# Altium schematic sheet MCU.SchDoc
size A3
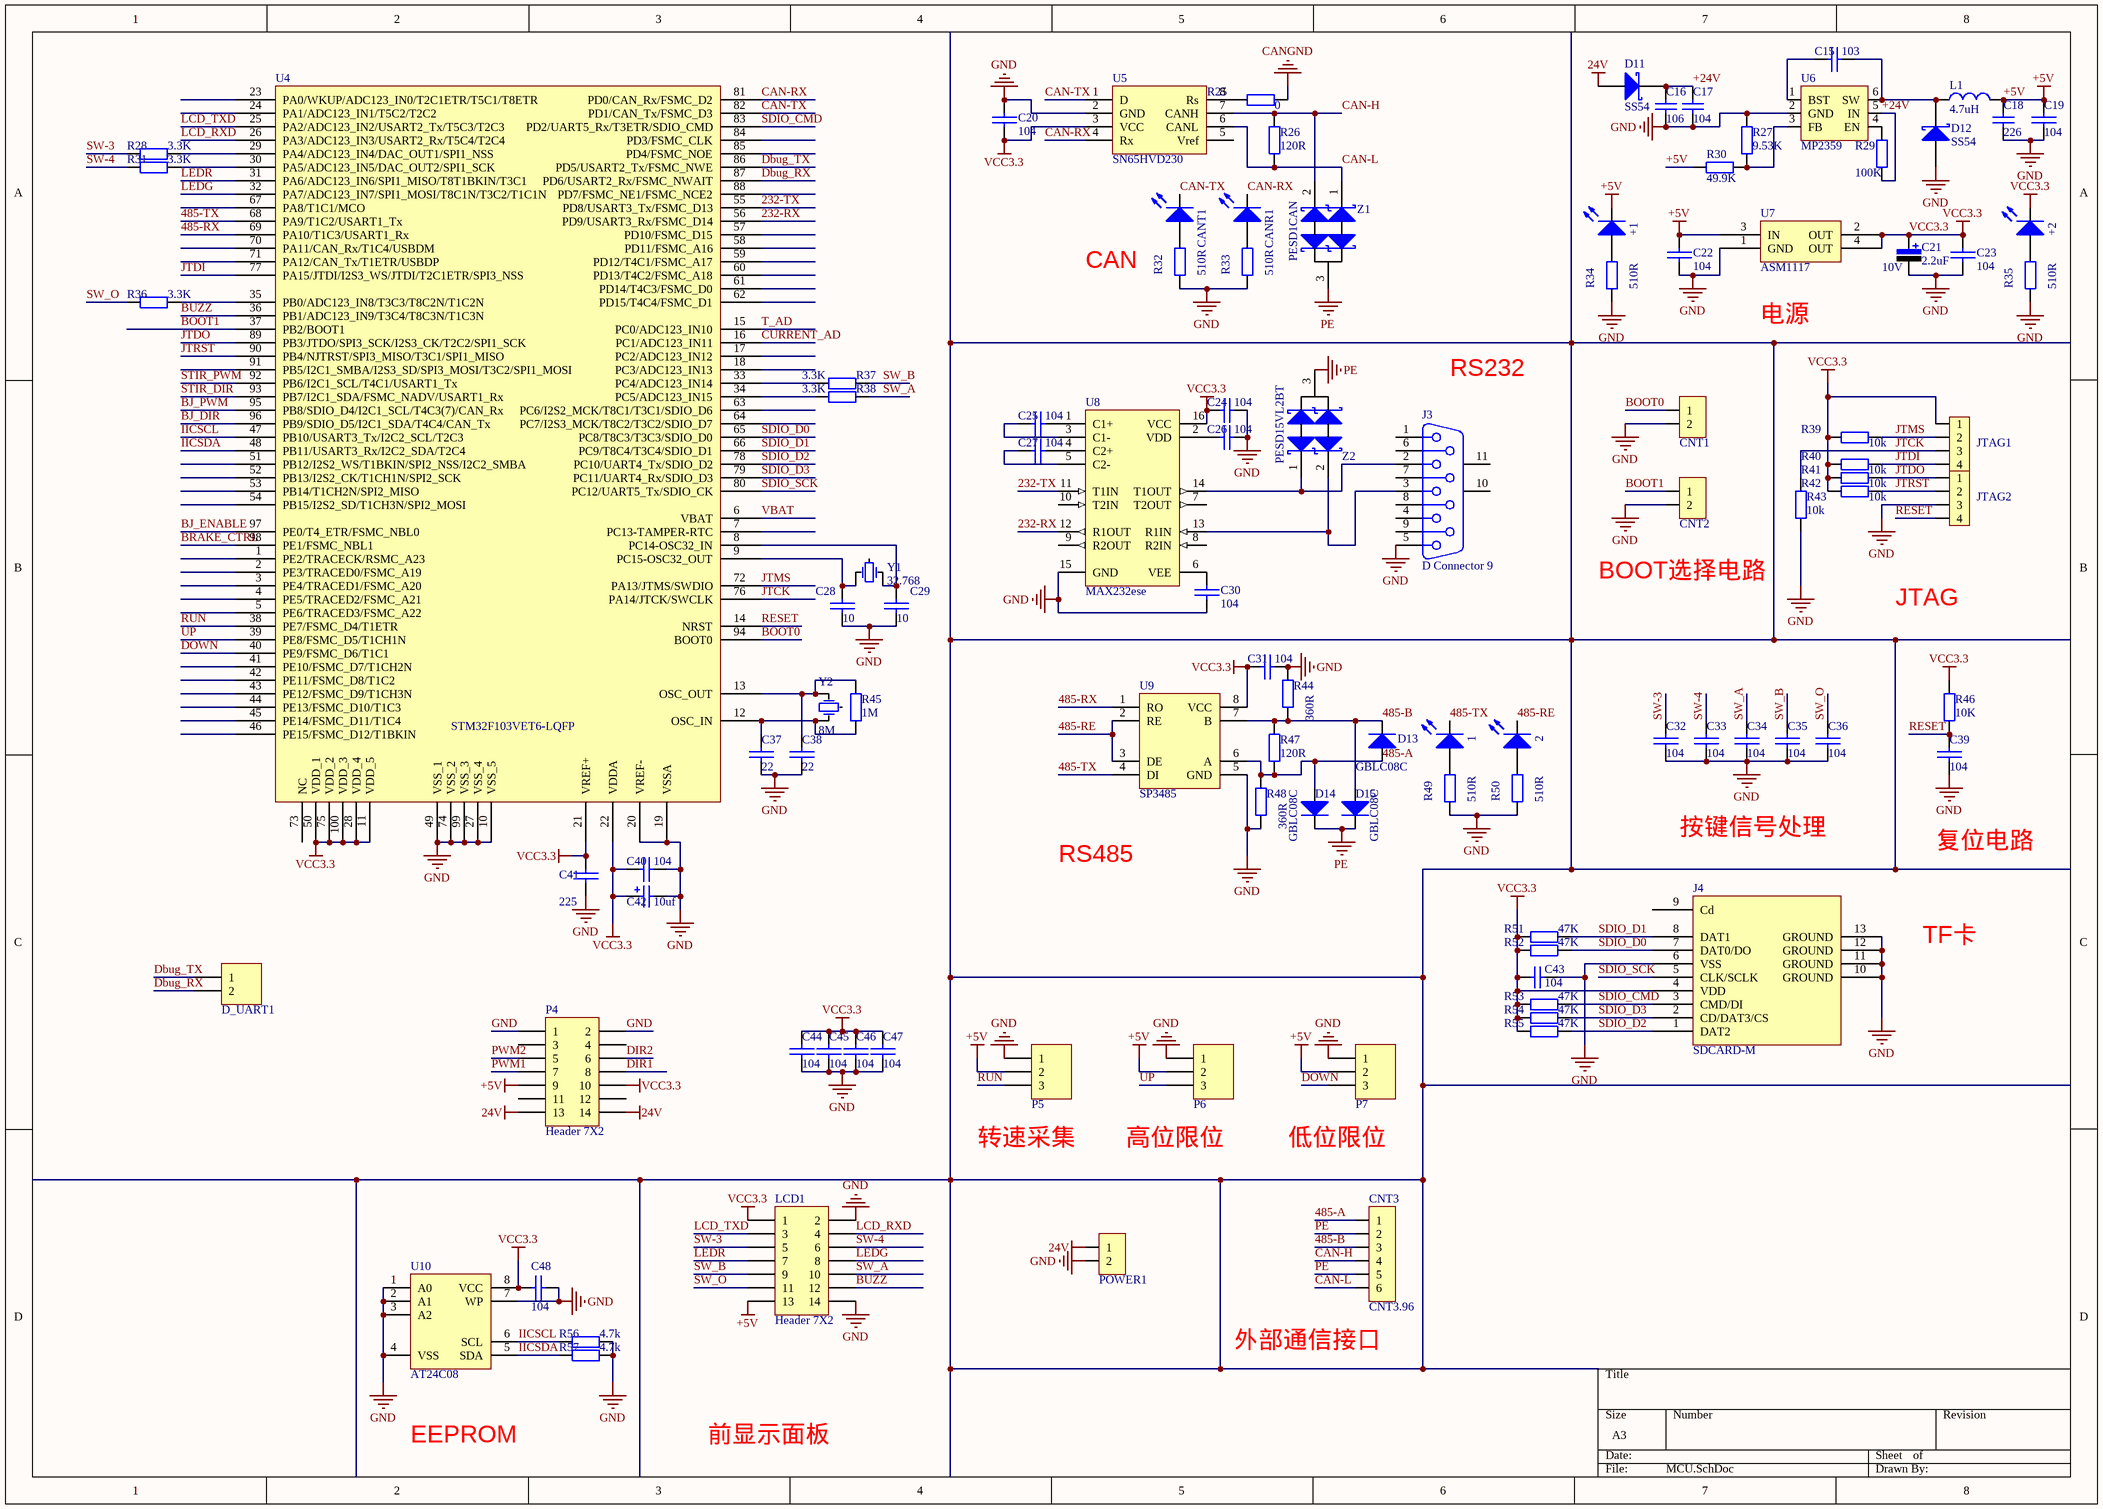
[diagram p0: MCU.SchDoc]

## Parts
1  COLOUR  [0603LED]  (value not drawn)
2  COLOUR  [0603LED]  (value not drawn)
+1  COLOUR  [0603LED]  (value not drawn)
+2  COLOUR  [0603LED]  (value not drawn)
C15  103  [0603C]
C16  容量: 106  [1210]  (hidden comment: 1210)
C17  value 104  [0603-2]  (hidden comment: Cap)
C18  value 226  [1206]  (hidden comment: Cap)
C19  104  [0603C]
C20  104  [0603C]
C21  value 2.2uF  Vol: 10V  [CAP-3216]  (hidden comment: Cap Pol)
C22  104  [0603C]
C23  104  [0603C]
C24  104  [0603C]
C25  104  [0603C]
C26  104  [0603C]
C27  104  [0603C]
C28  10  [0603C]
C29  10  [0603C]
C30  104  [0603C]
C31  104  [0603C]
C32  104  [0603C]
C33  104  [0603C]
C34  104  [0603C]
C35  104  [0603C]
C36  104  [0603C]
C37  22  [0603C]
C38  22  [0603C]
C39  104  [0603C]
C40  104  [0603C]
C41  225  [0603C]
C42  10uf  [ct3216-18]
C43  value 104  [C-RAD-0603]  (hidden comment: Cap)
C44  104  [0603C]
C45  104  [0603C]
C46  104  [0603C]
C47  104  [0603C]
C48  104  [0603C]
CANR1  COLOUR  [0603LED]  (value not drawn)
CANT1  COLOUR  [0603LED]  (value not drawn)
CNT1  cnt2p  [cont-1]  (value not drawn)
CNT2  cnt2p  [cont-1]  (value not drawn)
CNT3  CNT3.96  [CNT3.96]
D11  Type: SS54  [DIODE-SMA]  (hidden comment: D-Schottky)
D12  Type: SS54  [DIODE-SMA]  (hidden comment: D-Schottky)
D13  Type: GBLC08C  [DIODE-1206]  (hidden comment: TVS)
D14  Type: GBLC08C  [DIODE-1206]  (hidden comment: TVS)
D15  Type: GBLC08C  [DIODE-1206]  (hidden comment: TVS)
D_UART1  Header 2  [HDR2X1_A]  (value not drawn)
J3  D Connector 9  [DB9-F]
J4  SDCARD-M  [SDCARD-M]
JTAG1  单排插针11mm4p  [单排插针2.54]  (value not drawn)
JTAG2  单排插针11mm4p  [单排插针2.54]  (value not drawn)
L1  value 4.7uH  [L-SMD-7]  (hidden comment: Inductor)
LCD1  Header 7X2  [HDR7X2_A1]
P4  Header 7X2  [HDR7X2_A1]
P5  Header 3  [XH2.54*3卧贴]  (value not drawn)
P6  Header 3  [XH2.54*3卧贴]  (value not drawn)
P7  Header 3  [XH2.54*3卧贴]  (value not drawn)
POWER1  CNT5.08MM*2 WAN  [CNT5.08*2WAN]  (value not drawn)
R25  value 0  [0603-1]  (hidden comment: Res1)
R26  value 120R  [0603-1]  (hidden comment: Res1)
R27  value 9.53K  [0603-1]  (hidden comment: Res1)
R28  value 3.3K  [0603-1]  (hidden comment: Res1)
R29  value 100K  [0603-1]  (hidden comment: Res1)
R30  value 49.9K  [0603-1]  (hidden comment: Res1)
R31  value 3.3K  [0603-1]  (hidden comment: Res1)
R32  value 510R  [0603-1]  (hidden comment: Res1)
R33  value 510R  [0603-1]  (hidden comment: Res1)
R34  value 510R  [0603-1]  (hidden comment: Res1)
R35  value 510R  [0603-1]  (hidden comment: Res1)
R36  value 3.3K  [0603-1]  (hidden comment: Res1)
R37  value 3.3K  [0603-1]  (hidden comment: Res1)
R38  value 3.3K  [0603-1]  (hidden comment: Res1)
R39  value 10k  [0603-1]  (hidden comment: Res1)
R40  value 10k  [0603-1]  (hidden comment: Res1)
R41  value 10k  [0603-1]  (hidden comment: Res1)
R42  value 10k  [0603-1]  (hidden comment: Res1)
R43  value 10k  [0603-1]  (hidden comment: Res1)
R44  value 360R  [0603-1]  (hidden comment: Res1)
R45  value 1M  [0603-1]  (hidden comment: Res1)
R46  value 10K  [0603-1]  (hidden comment: Res1)
R47  value 120R  [0603-1]  (hidden comment: Res1)
R48  value 360R  [0603-1]  (hidden comment: Res1)
R49  value 510R  [0603-1]  (hidden comment: Res1)
R50  value 510R  [0603-1]  (hidden comment: Res1)
R51  value 47K  [0603-1]  (hidden comment: Res1)
R52  value 47K  [0603-1]  (hidden comment: Res1)
R53  value 47K  [0603-1]  (hidden comment: Res1)
R54  value 47K  [0603-1]  (hidden comment: Res1)
R55  value 47K  [0603-1]  (hidden comment: Res1)
R56  value 4.7k  [0603-1]  (hidden comment: Res1)
R57  value 4.7k  [0603-1]  (hidden comment: Res1)
U4  STM32F103VET6-LQFP  [LQFP-100_M]
U5  SN65HVD230  [NSO8_N]
U6  MP2359  [SOT23-6]
U7  ASM1117  [SOT-223]
U8  MAX232ese  [NSO16_M]
U9  SP3485  [NSO8_N]
U10  AT24C08  [SOIC8_N]
Y1  value 32.768  [MC-146]  (hidden comment: XTAL_SM)
Y2  value 8M  [xtal3225]  (hidden comment: XTAL_SM)
Z1  PESD1CAN  [SOT-23]
Z2  PESD15VL2BT  [SOT-23]

## Nets
24V: D11.1(A) P4.13 P4.14 POWER1.1
+5V: +1.2(-) C18.2 C19.1 C22.1 L1.2 LCD1.13 P4.9 P5.2 P6.2 P7.2 R30.2 U7.3(IN)
CANGND: R25.1
GND: C16.1 C17.1 C18.1 C19.2 C20.1 C21.2 C22.2 C23.2 C24.1 C26.1 C28.2 C29.2 C30.1 C31.1 C32.2 C33.2 C34.2 C35.2 C36.2 C37.2 C38.2 C39.1 C40.1 C41.1 C42.2 C43.2 C44.1 C45.1 C46.1 C47.1 C48.1 CNT1.2 CNT2.2 D12.1(A) J3.5 J4.6(VSS) J4.10(GROUND) J4.11(GROUND) J4.12(GROUND) J4.13(GROUND) JTAG2.3 LCD1.2 LCD1.14 P4.1 P4.2 P5.1 P6.1 P7.1 POWER1.2 R27.2 R32.1 R33.1 R34.1 R35.1 R43.2 R44.2 R48.1 R49.1 R50.1 R56.1 R57.1 U4.10(VSS_5) U4.19(VSSA) U4.20(VREF-) U4.27(VSS_4) U4.49(VSS_1) U4.74(VSS_2) U4.99(VSS_3) U5.2(GND) U6.2(GND) U7.1(GND) U8.15(GND) U9.5(GND) U10.1(A0) U10.2(A1) U10.3(A2) U10.4(VSS) U10.7(WP)
PE: CNT3.2 CNT3.5 D14.2(K) D15.2(K) Z1.3 Z2.3
VCC3.3: +2.2(-) C20.2 C21.1 C23.1 C24.2 C31.2 C40.2 C41.2 C42.1 C43.1 C44.2 C45.2 C46.2 C47.2 C48.2 J4.4(VDD) JTAG1.1 LCD1.1 P4.10 R39.2 R40.2 R41.2 R42.2 R46.2 R51.1 R52.1 R53.1 R54.1 R55.1 U4.11(VDD_5) U4.21(VREF+) U4.22(VDDA) U4.28(VDD_4) U4.50(VDD_1) U4.75(VDD_2) U4.100(VDD_3) U5.3(VCC) U7.2(OUT) U7.4(OUT) U8.16(VCC) U9.8(VCC) U10.8(VCC)
232-RX: U4.56(PD9/USART3_Rx/FSMC_D14) U8.12(R1OUT)
232-TX: U4.55(PD8/USART3_Tx/FSMC_D13) U8.11(T1IN)
485-A: CNT3.1 D13.1(A) D14.1(A) R47.1 R48.2 U9.6(A)
485-B: CNT3.3 D13.2(K) D15.1(A) R44.1 R47.2 U9.7(B)
485-RE: 2.2(-) U9.2(RE) U9.3(DE)
485-RX: U4.69(PA10/T1C3/USART1_Rx) U9.1(RO)
485-TX: 1.2(-) U4.68(PA9/T1C2/USART1_Tx) U9.4(DI)
+24V: C16.2 C17.2 D11.2(K) R29.1 U6.5(IN)
BJ_DIR: U4.96(PB9/SDIO_D5/I2C1_SDA/T4C4/CAN_Tx)
BJ_ENABLE: U4.97(PE0/T4_ETR/FSMC_NBL0)
BJ_PWM: U4.95(PB8/SDIO_D4/I2C1_SCL/T4C3(7)/CAN_Rx)
BOOT0: CNT1.1 U4.94(BOOT0)
BOOT1: CNT2.1 U4.37(PB2/BOOT1)
BRAKE_CTRL: U4.98(PE1/FSMC_NBL1)
BUZZ: LCD1.12 U4.36(PB1/ADC123_IN9/T3C4/T8C3N/T1C3N)
CAN-H: CNT3.4 R26.2 U5.7(CANH) Z1.2
CAN-L: CNT3.6 R26.1 U5.6(CANL) Z1.1
CAN-RX: CANR1.2(-) U4.81(PD0/CAN_Rx/FSMC_D2) U5.4(Rx)
CAN-TX: CANT1.2(-) U4.82(PD1/CAN_Tx/FSMC_D3) U5.1(D)
CURRENT_AD: U4.16(PC1/ADC123_IN11)
Dbug_RX: D_UART1.2 U4.87(PD6/USART2_Rx/FSMC_NWAIT)
Dbug_TX: D_UART1.1 U4.86(PD5/USART2_Tx/FSMC_NWE)
DIR1: P4.8
DIR2: P4.6
DOWN: P7.3 U4.40(PE9/FSMC_D6/T1C1)
IICSCL: R56.2 U4.47(PB10/USART3_Tx/I2C2_SCL/T2C3) U10.6(SCL)
IICSDA: R57.2 U4.48(PB11/USART3_Rx/I2C2_SDA/T2C4) U10.5(SDA)
JTCK: JTAG1.3 R43.1 U4.76(PA14/JTCK/SWCLK)
JTDI: JTAG1.4 R40.1 U4.77(PA15/JTDI/I2S3_WS/JTDI/T2C1ETR/SPI3_NSS)
JTDO: JTAG2.1 R41.1 U4.89(PB3/JTDO/SPI3_SCK/I2S3_CK/T2C2/SPI1_SCK)
JTMS: JTAG1.2 R39.1 U4.72(PA13/JTMS/SWDIO)
JTRST: JTAG2.2 R42.1 U4.90(PB4/NJTRST/SPI3_MISO/T3C1/SPI1_MISO)
LCD_RXD: LCD1.4 U4.26(PA3/ADC123_IN3/USART2_Rx/T5C4/T2C4)
LCD_TXD: LCD1.3 U4.25(PA2/ADC123_IN2/USART2_Tx/T5C3/T2C3)
LEDG: LCD1.8 U4.32(PA7/ADC123_IN7/SPI1_MOSI/T8C1N/T3C2/T1C1N)
LEDR: LCD1.7 U4.31(PA6/ADC123_IN6/SPI1_MISO/T8T1BKIN/T3C1)
PWM1: P4.7
PWM2: P4.5
RESET: C39.2 JTAG2.4 R46.1 U4.14(NRST)
RUN: P5.3 U4.38(PE7/FSMC_D4/T1ETR)
SDIO_CMD: J4.3(CMD/DI) R53.2 U4.83(PD2/UART5_Rx/T3ETR/SDIO_CMD)
SDIO_D0: J4.7(DAT0/DO) R52.2 U4.65(PC8/T8C3/T3C3/SDIO_D0)
SDIO_D1: J4.8(DAT1) R51.2 U4.66(PC9/T8C4/T3C4/SDIO_D1)
SDIO_D2: J4.1(DAT2) R55.2 U4.78(PC10/UART4_Tx/SDIO_D2)
SDIO_D3: J4.2(CD/DAT3/CS) R54.2 U4.79(PC11/UART4_Rx/SDIO_D3)
SDIO_SCK: J4.5(CLK/SCLK) U4.80(PC12/UART5_Tx/SDIO_CK)
STIR_DIR: U4.93(PB7/I2C1_SDA/FSMC_NADV/USART1_Rx)
STIR_PWM: U4.92(PB6/I2C1_SCL/T4C1/USART1_Tx)
SW-3: C32.1 LCD1.5 R28.2
SW-4: C33.1 LCD1.6 R31.2
SW_A: C34.1 LCD1.10 R38.2
SW_B: C35.1 LCD1.9 R37.2
SW_O: C36.1 LCD1.11 R36.2
T_AD: U4.15(PC0/ADC123_IN10)
UP: P6.3 U4.39(PE8/FSMC_D5/T1CH1N)
VBAT: U4.6(VBAT)
Net1_1: 1.1(+) R49.2
Net2_1: 2.1(+) R50.2
Net+1_1: +1.1(+) R34.2
Net+2_1: +2.1(+) R35.2
NetC15_1: C15.1 U6.1(BST)
NetC15_2: C15.2 D12.2(K) L1.1 U6.6(SW)
NetC25_1: C25.1 U8.1(C1+)
NetC25_2: C25.2 U8.3(C1-)
NetC26_2: C26.2 U8.2(VDD)
NetC27_1: C27.1 U8.4(C2+)
NetC27_2: C27.2 U8.5(C2-)
NetC28_1: C28.1 U4.9(PC15-OSC32_OUT) Y1.1(OSC1)
NetC29_1: C29.1 U4.8(PC14-OSC32_IN) Y1.2(OSC2)
NetC30_2: C30.2 U8.6(VEE)
NetC37_1: C37.1 R45.1 U4.12(OSC_IN) Y2.1(OSC1)
NetC38_1: C38.1 R45.2 U4.13(OSC_OUT) Y2.2(OSC2)
NetCANR1_1: CANR1.1(+) R33.2
NetCANT1_1: CANT1.1(+) R32.2
NetJ3_2: J3.2 U8.14(T1OUT) Z2.1
NetJ3_3: J3.3 U8.13(R1IN) Z2.2
NetR25_2: R25.2 U5.8(Rs)
NetR27_1: R27.1 R30.1 U6.3(FB)
NetR28_1: R28.1 U4.29(PA4/ADC123_IN4/DAC_OUT1/SPI1_NSS)
NetR29_2: R29.2 U6.4(EN)
NetR31_1: R31.1 U4.30(PA5/ADC123_IN5/DAC_OUT2/SPI1_SCK)
NetR36_1: R36.1 U4.35(PB0/ADC123_IN8/T3C3/T8C2N/T1C2N)
NetR37_1: R37.1 U4.33(PC4/ADC123_IN14)
NetR38_1: R38.1 U4.34(PC5/ADC123_IN15)

Not connected (* = marked no-connect by the designer): J3 1 4 6 7 8 9 10(MH1) 11(MH2); J4 9(Cd); P4 3 4 11 12; U4 1(PE2/TRACECK/RSMC_A23) 2(PE3/TRACED0/FSMC_A19) 3(PE4/TRACED1/FSMC_A20) 4(PE5/TRACED2/FSMC_A21) 5(PE6/TRACED3/FSMC_A22) 7(PC13-TAMPER-RTC) 17(PC2/ADC123_IN12) 18(PC3/ADC123_IN13) 23(PA0/WKUP/ADC123_IN0/T2C1ETR/T5C1/T8ETR) 24(PA1/ADC123_IN1/T5C2/T2C2) 41(PE10/FSMC_D7/T1CH2N) 42(PE11/FSMC_D8/T1C2) 43(PE12/FSMC_D9/T1CH3N) 44(PE13/FSMC_D10/T1C3) 45(PE14/FSMC_D11/T1C4) 46(PE15/FSMC_D12/T1BKIN) 51(PB12/I2S2_WS/T1BKIN/SPI2_NSS/I2C2_SMBA) 52(PB13/I2S2_CK/T1CH1N/SPI2_SCK) 53(PB14/T1CH2N/SPI2_MISO) 54(PB15/I2S2_SD/T1CH3N/SPI2_MOSI) 57(PD10/FSMC_D15) 58(PD11/FSMC_A16) 59(PD12/T4C1/FSMC_A17) 60(PD13/T4C2/FSMC_A18) 61(PD14/T4C3/FSMC_D0) 62(PD15/T4C4/FSMC_D1) 63(PC6/I2S2_MCK/T8C1/T3C1/SDIO_D6) 64(PC7/I2S3_MCK/T8C2/T3C2/SDIO_D7) 67(PA8/T1C1/MCO) 70(PA11/CAN_Rx/T1C4/USBDM) 71(PA12/CAN_Tx/T1ETR/USBDP) 73(NC) 84(PD3/FSMC_CLK) 85(PD4/FSMC_NOE) 88(PD7/FSMC_NE1/FSMC_NCE2) 91(PB5/I2C1_SMBA/I2S3_SD/SPI3_MOSI/T3C2/SPI1_MOSI); U5 5(Vref); U8 7(T2OUT) 8(R2IN) 9(R2OUT) 10(T2IN); Y1 3; Y2 3

## Notes on the sheet
- CAN
- RS232
- 电源
- BOOT选择电路
- JTAG
- 按键信号处理
- 复位电路
- RS485
- TF卡
- (near P5) 转速采集
- (near P6) 高位限位
- (near P7) 低位限位
- 外部通信接口
- EEPROM
- 前显示面板

## Library data of the parts
1 2 +1 +2 CANR1 CANT1 = ledφ6
C15 C19 C20 C22-C41 C44-C48 = CAP X: 安规电容
C16-C18 C43 = Cap: 无极性电容; Published: 8-Jun-2000; LatestRevisionDate: 17-Jul-2002; LatestRevisionNote: Re-released for DXP Platform.; PackageReference: RAD-0.3; Publisher: Altium Limited
C21 = Cap Pol: 极性电解电容; Published: 8-Jun-2000; LatestRevisionDate: 17-Jul-2002; LatestRevisionNote: Re-released for DXP Platform.; PackageReference: RB7.6-15; Publisher: Altium Limited
C42 = CAP: 电解电容
CNT3 = CNT3.96: 接线端子(3.96MM)
D11 D12 = D-Schottky: 肖特基二极管; Published: 8-Jun-2000; LatestRevisionDate: 17-Jul-2002; LatestRevisionNote: Re-released for DXP Platform.; PackageReference: SMB; Publisher: Altium Limited; Code_JEDEC: DO-214-AA
D13-D15 = TVS: TVS保护; Published: 8-Jun-2000; LatestRevisionDate: 17-Jul-2002; LatestRevisionNote: Re-released for DXP Platform.; PackageDocument: Sep-1996; PackageReference: SMC; Publisher: Altium Limited; Code_JEDEC: DO-214-AB
D_UART1 = Header 2: 接插件; LatestRevisionDate: 17-Jul-2002; LatestRevisionNote: Re-released for DXP Platform.; Publisher: Altium Limited
J3 = D Connector 9: 串口; PackageDocument: O; Positions: 9; Gender: Receptacle; Published: 15-Jun-2001; LatestRevisionDate: 17-Jul-2002; LatestRevisionNote: Re-released for DXP Platform.; DatasheetDocument: 1-Sep-1999; PackageReference: 788750; Publisher: Altium Limited; Orientation: Right Angle
J4 = SDCARD-M: TF卡槽
L1 = Inductor: 电感; Code_IEC: 1005; Published: 8-Jun-2000; LatestRevisionDate: 17-Jul-2002; LatestRevisionNote: Re-released for DXP Platform.; PackageReference: 0402-A; Publisher: Altium Limited; Code_JEITA: 0402
LCD1 P4 = Header 7X2: Header, 7-Pin; LatestRevisionDate: 17-Jul-2002; LatestRevisionNote: Re-released for DXP Platform.; Publisher: Altium Limited
P5-P7 = Header 3: 接插件; LatestRevisionDate: 17-Jul-2002; LatestRevisionNote: Re-released for DXP Platform.; Publisher: Altium Limited
R25-R57 = Res1: 贴片电阻; Published: 8-Jun-2000; LatestRevisionDate: 17-Jul-2002; LatestRevisionNote: Re-released for DXP Platform.; PackageReference: AXIAL-0.4; Publisher: Altium Limited
U4 = STM32F103V: STM32单片机100引脚
U5 = SN65HVD230: CAN芯片
U6 = MP2359: DC降压24V 1.2A
U7 = ASM1117: 3.3V稳压芯片
U8 = MAX232: +5V Powered, Multi-Channel RS-232 Driver/Receiver; Published: 16-Jan-2001; LatestRevisionDate: 13-Apr-2006; LatestRevisionNote: IPC-7351 Footprint Added.; PackageReference: NSO16; Publisher: Altium Limited; PackageDescription: 16-Pin Small Outline Integrated Circuit 1.27 mm Pitch; Code_JEDEC: MS-012-AC; Code_IPC: SOIC127P600-16; ComponentLink1Description: Manufacturer Link; ComponentLink1URL: http://www.maxim-ic.com/; ComponentLink2Description: Datasheet; ComponentLink2URL: http://pdfserv.maxim-ic.com/en/ds/MAX220-MAX249.pdf
U9 = SP3485: 485总线芯片
U10 = AT24C02: EEROM存储器
Y1 Y2 = XTAL_SM: 圆柱晶振; Published: 8-Jun-2000; LatestRevisionDate: 17-Jul-2002; LatestRevisionNote: Re-released for DXP Platform.; PackageReference: R38; Publisher: Altium Limited
Z1 Z2 = PESD1CAN: 过压保护